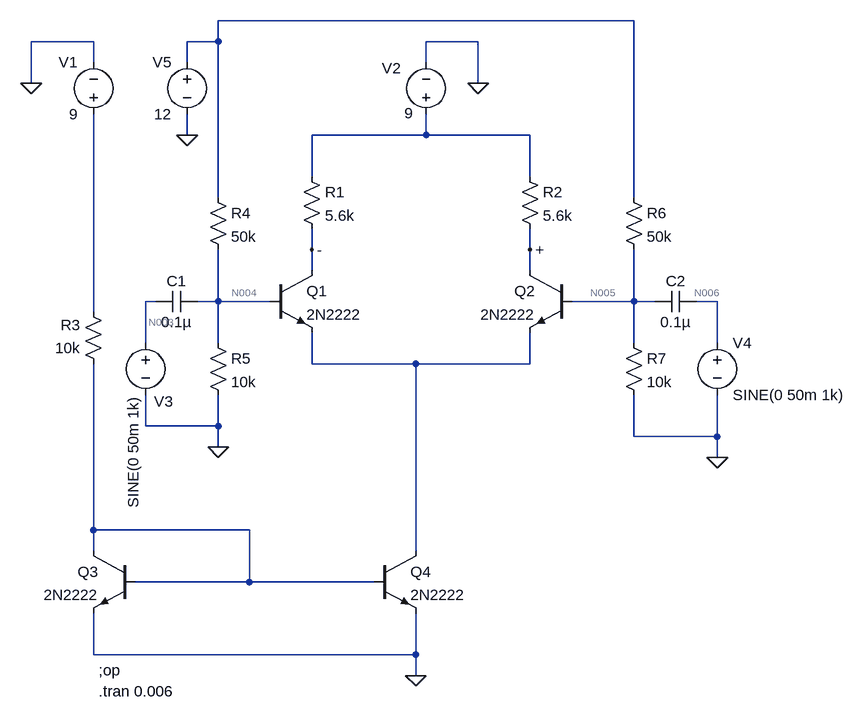
[diagram p0: schematic task.asc]
task.asc, the LTspice schematic file:
Version 4
SHEET 1 880 1000
WIRE 448 -160 -192 -160
WIRE -384 -128 -480 -128
WIRE -192 -128 -192 -160
WIRE -192 -128 -240 -128
WIRE 208 -128 128 -128
WIRE -384 -96 -384 -128
WIRE -240 -96 -240 -128
WIRE 128 -96 128 -128
WIRE -480 -64 -480 -128
WIRE 208 -64 208 -128
WIRE -240 16 -240 -16
WIRE 128 16 128 -16
WIRE 128 16 -48 16
WIRE 288 16 128 16
WIRE -48 80 -48 16
WIRE 288 80 288 16
WIRE -192 112 -192 -128
WIRE 448 112 448 -160
WIRE -48 192 -48 160
WIRE 288 192 288 160
WIRE -48 224 -48 192
WIRE 288 224 288 192
WIRE -288 272 -304 272
WIRE -192 272 -192 192
WIRE -192 272 -224 272
WIRE -112 272 -192 272
WIRE 448 272 448 192
WIRE 448 272 352 272
WIRE 480 272 448 272
WIRE 576 272 544 272
WIRE -384 288 -384 -16
WIRE -304 336 -304 272
WIRE -192 336 -192 272
WIRE 448 336 448 272
WIRE 576 336 576 272
WIRE -48 368 -48 320
WIRE 112 368 -48 368
WIRE 288 368 288 320
WIRE 288 368 112 368
WIRE -304 464 -304 416
WIRE -192 464 -192 416
WIRE -192 464 -304 464
WIRE 448 480 448 416
WIRE 576 480 576 416
WIRE 576 480 448 480
WIRE -192 496 -192 464
WIRE 576 512 576 480
WIRE -384 624 -384 368
WIRE -144 624 -384 624
WIRE -384 656 -384 624
WIRE 112 656 112 368
WIRE -144 704 -144 624
WIRE -144 704 -320 704
WIRE 48 704 -144 704
WIRE -384 816 -384 752
WIRE 112 816 112 752
WIRE 112 816 -384 816
WIRE 112 848 112 816
FLAG 208 -64 0
FLAG -192 496 0
FLAG -480 -64 0
FLAG 576 512 0
FLAG -240 16 0
FLAG 112 848 0
FLAG 288 192 +
FLAG -48 192 -
SYMBOL res -64 64 R0
SYMATTR InstName R1
SYMATTR Value 5.6k
SYMBOL res 272 64 R0
SYMATTR InstName R2
SYMATTR Value 5.6k
SYMBOL res -368 384 R180
WINDOW 0 36 76 Left 2
WINDOW 3 36 40 Left 2
SYMATTR InstName R3
SYMATTR Value 10k
SYMBOL voltage 128 0 R180
WINDOW 0 39 87 Left 2
WINDOW 3 20 18 Left 2
WINDOW 123 0 0 Left 0
WINDOW 39 0 0 Left 0
SYMATTR InstName V2
SYMATTR Value 9
SYMBOL npn 48 656 R0
SYMATTR InstName Q4
SYMATTR Value 2N2222
SYMBOL npn -112 224 R0
SYMATTR InstName Q1
SYMATTR Value 2N2222
SYMBOL npn -320 656 M0
SYMATTR InstName Q3
SYMATTR Value 2N2222
SYMBOL npn 352 224 M0
SYMATTR InstName Q2
SYMATTR Value 2N2222
SYMBOL res -208 96 R0
SYMATTR InstName R4
SYMATTR Value 50k
SYMBOL res -208 320 R0
SYMATTR InstName R5
SYMATTR Value 10k
SYMBOL cap -224 256 R90
WINDOW 0 0 32 VBottom 2
WINDOW 3 32 32 VTop 2
SYMATTR InstName C1
SYMATTR Value 0.1µ
SYMBOL voltage -304 320 R0
WINDOW 0 13 106 Left 2
WINDOW 3 -19 98 VRight 2
WINDOW 123 0 0 Left 0
WINDOW 39 0 0 Left 0
SYMATTR InstName V3
SYMATTR Value SINE(0 50m 1k)
SYMBOL voltage -384 0 R180
WINDOW 0 24 96 Left 2
WINDOW 3 24 16 Left 2
WINDOW 123 0 0 Left 0
WINDOW 39 0 0 Left 0
SYMATTR InstName V1
SYMATTR Value 9
SYMBOL res 432 96 R0
SYMATTR InstName R6
SYMATTR Value 50k
SYMBOL res 432 320 R0
SYMATTR InstName R7
SYMATTR Value 10k
SYMBOL voltage 576 320 R0
WINDOW 123 0 0 Left 0
WINDOW 39 0 0 Left 0
SYMATTR InstName V4
SYMATTR Value SINE(0 50m 1k)
SYMBOL cap 544 256 R90
WINDOW 0 0 32 VBottom 2
WINDOW 3 32 32 VTop 2
SYMATTR InstName C2
SYMATTR Value 0.1µ
SYMBOL voltage -240 -112 M0
SYMATTR InstName V5
SYMATTR Value 12
TEXT -376 840 Left 2 !;op
TEXT -376 872 Left 2 !.tran 0.006

The netlist it stands for:
* task.asc
R1 N002 - 5.6k
R2 N002 + 5.6k
R3 N009 N007 10k
V2 N002 0 9
Q4 N008 N009 0 0 2N2222
Q1 - N004 N008 0 2N2222
Q3 N009 N009 0 0 2N2222
Q2 + N005 N008 0 2N2222
R4 N001 N004 50k
R5 N004 0 10k
C1 N004 N003 0.1µ
V3 N003 0 SINE(0 50m 1k)
V1 N007 0 9
R6 N001 N005 50k
R7 N005 0 10k
V4 N006 0 SINE(0 50m 1k)
C2 N006 N005 0.1µ
V5 N001 0 12
.model NPN NPN
.model PNP PNP
.lib standard.bjt
;op
.tran 0.006
.backanno
.end

* Results of the author's LTspice run, read from the files saved beside the schematic
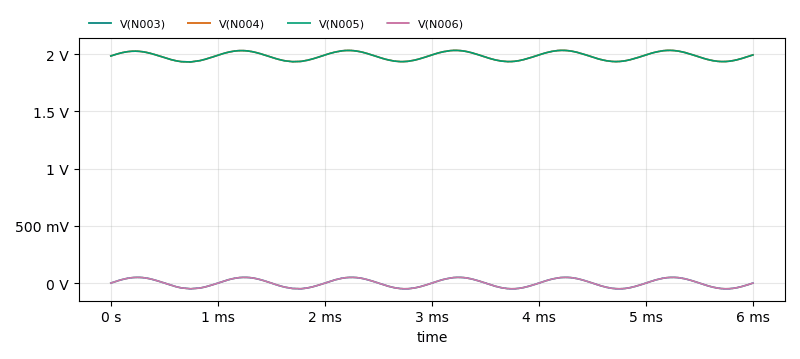
[diagram p1: Transient Analysis of task.asc, plotted from the saved traces]
* Transient Analysis, 1 run:
*   V(N003): min -49.99 mV, max 50 mV, average 82.36 µV, rms 35.31 mV, last 0 V
*   V(N004): min 1.931 V, max 2.033 V, average 1.982 V, rms 1.983 V, last 1.993 V
*   V(N005): min 1.931 V, max 2.033 V, average 1.982 V, rms 1.983 V, last 1.993 V
*   V(N006): min -49.99 mV, max 50 mV, average 82.36 µV, rms 35.31 mV, last 0 V